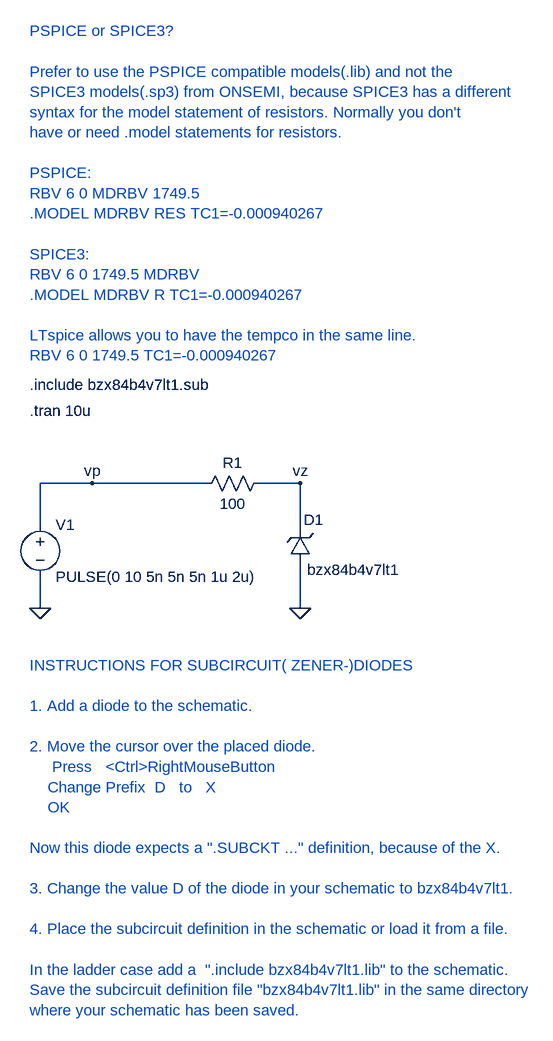
[diagram p0: schematic BZX84B4V7_ONSEMI_test.asc]
BZX84B4V7_ONSEMI_test.asc, the LTspice schematic file:
Version 4
SHEET 1 1488 1540
WIRE -240 192 -240 128
WIRE -240 320 -240 272
WIRE -160 128 -240 128
WIRE 16 128 -160 128
WIRE 160 128 96 128
WIRE 160 192 160 128
WIRE 160 320 160 256
FLAG -240 320 0
FLAG 160 320 0
FLAG -160 128 vp
FLAG 160 128 vz
SYMBOL voltage -240 176 R0
WINDOW 123 0 0 Left 0
WINDOW 39 0 0 Left 0
SYMATTR InstName V1
SYMATTR Value PULSE(0 10 5n 5n 5n 1u 2u)
SYMBOL res 0 144 R270
WINDOW 0 32 56 VTop 0
WINDOW 3 0 56 VBottom 0
SYMATTR InstName R1
SYMATTR Value 100
SYMBOL zener 176 256 R180
WINDOW 0 -20 72 Left 0
WINDOW 3 5 -5 Right 0
SYMATTR InstName D1
SYMATTR Value bzx84b4v7lt1
SYMATTR Prefix X
TEXT -256 16 Left 0 !.tran 10u
TEXT -256 408 Left 0 ;INSTRUCTIONS FOR SUBCIRCUIT( ZENER-)DIODES\n \n1. Add a diode to the schematic.\n \n2. Move the cursor over the placed diode.\n     Press   <Ctrl>RightMouseButton\n    Change Prefix  D   to   X\n    OK\n \nNow this diode expects a ".SUBCKT ..." definition, because of the X.\n \n3. Change the value D of the diode in your schematic to bzx84b4v7lt1.\n \n4. Place the subcircuit definition in the schematic or load it from a file.\n \nIn the ladder case add a  ".include bzx84b4v7lt1.lib" to the schematic.\nSave the subcircuit definition file "bzx84b4v7lt1.lib" in the same directory\nwhere your schematic has been saved.
TEXT -256 -24 Left 0 !.include bzx84b4v7lt1.sub
TEXT -256 -568 Left 0 ;PSPICE or SPICE3?\n \nPrefer to use the PSPICE compatible models(.lib) and not the\nSPICE3 models(.sp3) from ONSEMI, because SPICE3 has a different\nsyntax for the model statement of resistors. Normally you don't\nhave or need .model statements for resistors.\n \nPSPICE:\nRBV 6 0 MDRBV 1749.5\n.MODEL MDRBV RES TC1=-0.000940267\n \nSPICE3:\nRBV 6 0 1749.5 MDRBV\n.MODEL MDRBV R TC1=-0.000940267\n \nLTspice allows you to have the tempco in the same line.\nRBV 6 0 1749.5 TC1=-0.000940267

The netlist it stands for:
* BZX84B4V7_ONSEMI_test.asc
V1 vp 0 PULSE(0 10 5n 5n 5n 1u 2u)
R1 vp vz 100
XD1 0 vz bzx84b4v7lt1  ; pins + -
.tran 10u
* INSTRUCTIONS FOR SUBCIRCUIT( ZENER-)DIODES
* 1. Add a diode to the schematic.
* 2. Move the cursor over the placed diode.
*      Press   <Ctrl>RightMouseButton
*     Change Prefix  D   to   X
*     OK
* Now this diode expects a ".SUBCKT ..." definition, because of the X.
* 3. Change the value D of the diode in your schematic to bzx84b4v7lt1.
* 4. Place the subcircuit definition in the schematic or load it from a file.
* In the ladder case add a  ".include bzx84b4v7lt1.lib" to the schematic.
* Save the subcircuit definition file "bzx84b4v7lt1.lib" in the same directory
* where your schematic has been saved.
.include bzx84b4v7lt1.sub
* PSPICE or SPICE3?
* Prefer to use the PSPICE compatible models(.lib) and not the
* SPICE3 models(.sp3) from ONSEMI, because SPICE3 has a different
* syntax for the model statement of resistors. Normally you don't
* have or need .model statements for resistors.
* PSPICE:
* RBV 6 0 MDRBV 1749.5
* .MODEL MDRBV RES TC1=-0.000940267
* SPICE3:
* RBV 6 0 1749.5 MDRBV
* .MODEL MDRBV R TC1=-0.000940267
* LTspice allows you to have the tempco in the same line.
* RBV 6 0 1749.5 TC1=-0.000940267
.backanno
.end